# EAGLE schematic GSM (EAGLE 5.11)
PARTNO: LD1117AS33
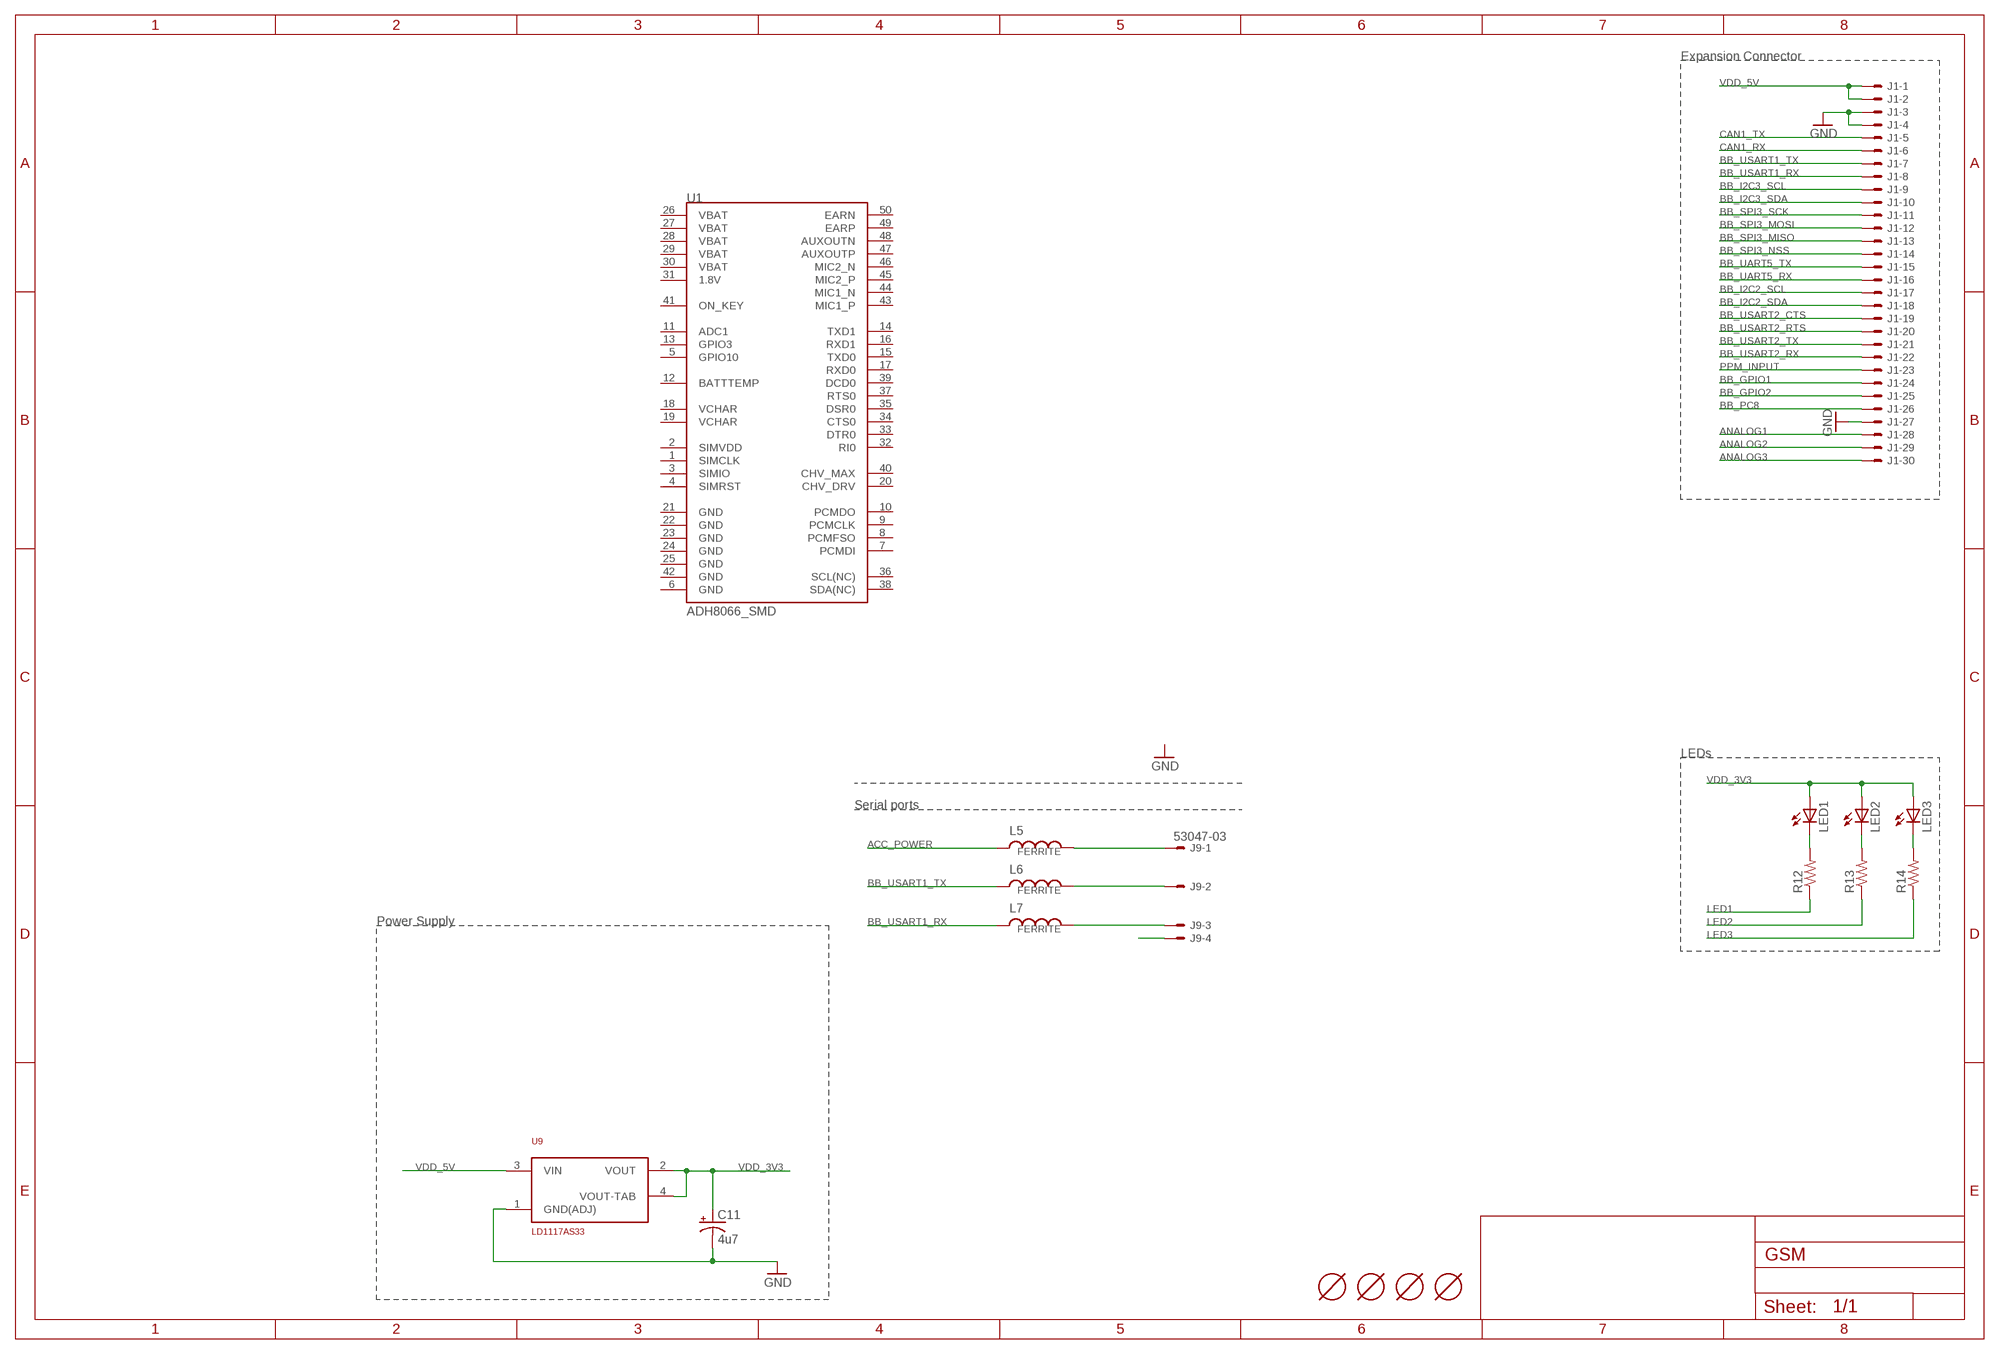
[diagram p0: schematic, sheet 1]

## Parts
C11  4u7  CAP_POL1206  [EIA3216]
J1  HEADER_2X15-REV  [HEADER_2MM_2X15_REVERSE]
J9  53047-03  53047-04  [53047-04]
L5  FERRITE  INDUCTOR0402  [C0402]
L6  FERRITE  INDUCTOR0402  [C0402]
L7  FERRITE  INDUCTOR0402  [C0402]
LED1  LED0603  [LED-0603]
LED2  LED0603  [LED-0603]
LED3  LED0603  [LED-0603]
R12  RESISTOR0402-RES  [0402-RES]
R13  RESISTOR0402-RES  [0402-RES]
R14  RESISTOR0402-RES  [0402-RES]
U1  ADH8066_SMD  [ADH8066]
U9  LD1117AS33  [SOT-223]
U$3  MOUNT-HOLE2.1MM  [MOUNT-HOLE2.1]
U$4  MOUNT-HOLE2.1MM  [MOUNT-HOLE2.1]
U$5  MOUNT-HOLE2.1MM  [MOUNT-HOLE2.1]
U$6  MOUNT-HOLE2.1MM  [MOUNT-HOLE2.1]

## Nets
ACC_POWER: L5.1
ANALOG1: J1.28
ANALOG2: J1.29
ANALOG3: J1.30
BB_GPIO1: J1.24
BB_GPIO2: J1.25
BB_I2C2_SCL: J1.17
BB_I2C2_SDA: J1.18
BB_I2C3_SCL: J1.9
BB_I2C3_SDA: J1.10
BB_PC8: J1.26
BB_SPI3_MISO: J1.13
BB_SPI3_MOSI: J1.12
BB_SPI3_NSS: J1.14
BB_SPI3_SCK: J1.11
BB_UART5_RX: J1.16
BB_UART5_TX: J1.15
BB_USART1_RX: J1.8 L7.1
BB_USART1_TX: J1.7 L6.1
BB_USART2_CTS: J1.19
BB_USART2_RTS: J1.20
BB_USART2_RX: J1.22
BB_USART2_TX: J1.21
CAN1_RX: J1.6
CAN1_TX: J1.5
GND: C11.C(-) J1.3 J1.4 J1.27 U9.1(GND(ADJ))
LED1: R12.1
LED2: R13.1
LED3: R14.1
N$3: J9.1 L5.2
N$7: J9.4
N$8: LED1.C R12.2
N$26: J9.3 L7.2
N$31: LED2.C R13.2
N$38: LED3.C R14.2
N$41: J9.2 L6.2
PPM_INPUT: J1.23
VDD_3V3: C11.A(+) LED1.A LED2.A LED3.A U9.2(VOUT) U9.4(VOUT-TAB)
VDD_5V: J1.1 J1.2 U9.3(VIN)
Unconnected: U1.1(SIMCLK) U1.2(SIMVDD) U1.3(SIMIO) U1.4(SIMRST) U1.5(GPIO10) U1.6(GND) U1.7(PCMDI) U1.8(PCMFSO) U1.9(PCMCLK) U1.10(PCMDO) U1.11(ADC1) U1.12(BATTTEMP) U1.13(GPIO3) U1.14(TXD1) U1.15(TXD0) U1.16(RXD1) U1.17(RXD0) U1.18(VCHAR) U1.19(VCHAR) U1.20(CHV_DRV) U1.21(GND) U1.22(GND) U1.23(GND) U1.24(GND) U1.25(GND) U1.26(VBAT) U1.27(VBAT) U1.28(VBAT) U1.29(VBAT) U1.30(VBAT) U1.31(1.8V) U1.32(RI0) U1.33(DTR0) U1.34(CTS0) U1.35(DSR0) U1.36(SCL(NC)) U1.37(RTS0) U1.38(SDA(NC)) U1.39(DCD0) U1.40(CHV_MAX) U1.41(ON_KEY) U1.42(GND) U1.43(MIC1_P) U1.44(MIC1_N) U1.45(MIC2_P) U1.46(MIC2_N) U1.47(AUXOUTP) U1.48(AUXOUTN) U1.49(EARP) U1.50(EARN)

## Notes on the sheet
- Expansion Connector
- LEDs
- Serial ports
- Power Supply

## Library data of the parts
C11 = pixhawk2:CAP_POL: Capacitor Polarized These are standard SMD and PTH capacitors. Normally 10uF, 47uF, and 100uF in electrolytic and tantalum varieties. Always verify the external diameter of the through hole cap, it varies with capacity, voltage, and manufacturer. The EIA devices should be standard.
J1 = pixhawk2:HEADER_2X15: 2X15 header
J9 = pixhawk2:53?-04: CONNECTOR wire to board 1.25 mm (.049 inch) pitch header
L5-L7 = pixhawk2:INDUCTOR: Inductors Basic Inductor/Choke - 0603 and 1206. Footprints are not proven and vary greatly between part numbers.
LED1-LED3 = pixhawk2:LED: LEDs Standard schematic elements and footprints for 5mm, 3mm, 1206, and 0603 sized LEDs. 5mm - Spark Fun Electronics SKU : COM-00529 (and others)
R12-R14 = pixhawk2:RESISTOR: Resistor Basic schematic elements and footprints for 0603, 1206, and PTH 1/10th watt (small) resistors.
U1 = pixhawk2:ADH8066: 8066-GSM-GPRS module from ADH-Tech
U9 = pixhawk2:LD1117A: LD1117A LDO Datasheet: http://www.st.com/stonline/books/pdf/docs/7194.pdf
U$3-U$6 = pixhawk2:MOUNT-HOLE

## Net classes
1 power: width 0.254 mm, drill 0.3 mm, clearance 0.203 mm